# Altium schematic sheet SCH - ROBOTIC ARM.SchDoc
size A3; SheetNumber: 1; SheetTotal: 1
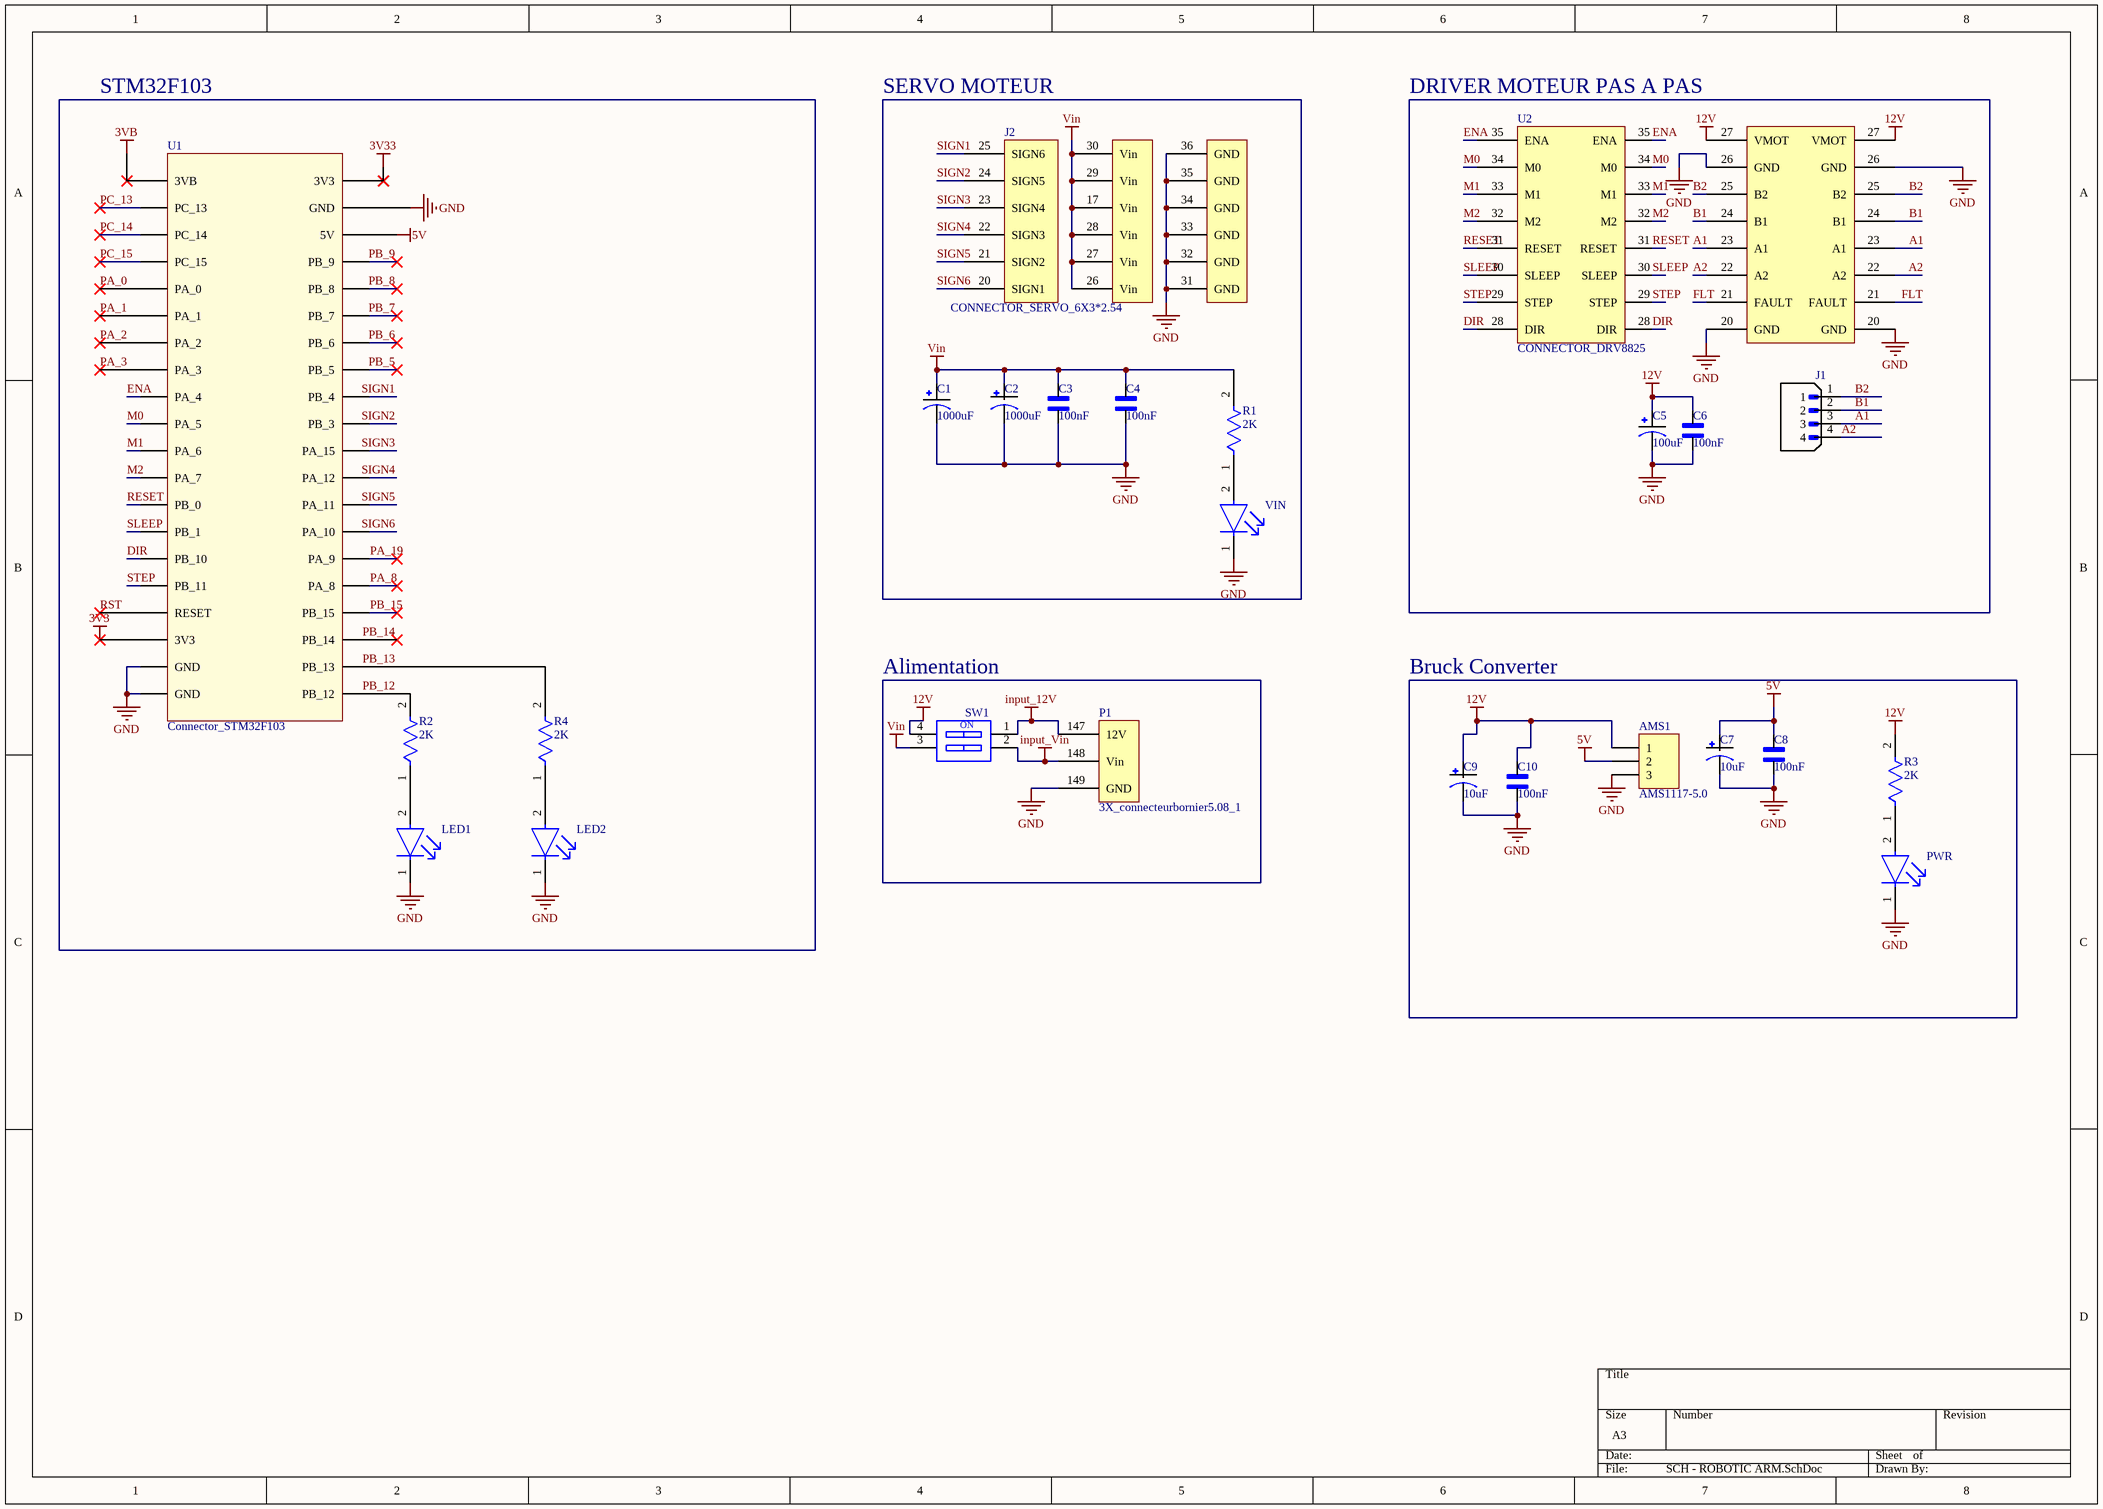
[diagram p0: SCH - ROBOTIC ARM.SchDoc]

## Parts
AMS1  AMS1117-5.0  [HDR1X3]
C1  1000uF  [*CAPPRD500W60D1000H1600_ECA1CM102(Primary)]
C2  1000uF  [*CAPPRD200W50D550H1250]
C3  100nF  [*CAPRR508W50L508T317H508]
C4  100nF  [*CAPRR508W50L508T317H508]
C5  100uF  [*CAPPRD500W60D1000H1600_ECA1CM102(Primary)]
C6  100nF  [*CAPRR508W50L508T317H508]
C7  10uF  [*CAPPRD200W50D550H1250]
C8  100nF  [*CAPRR508W50L508T317H508]
C9  10uF  [*CAPPRD200W50D550H1250]
C10  100nF  [*CAPPRD200W50D550H1250]
J1  B4B-XH-A(LF)(SN)  [*JST_B4B-XH-A(LF)(SN)]  (value not drawn)
J2  CONNECTOR_SERVO_6X3*2.54  [CONNECTOR_SERVO_6X3*2.54]
LED1  LED1  [FP-VSLB3940-MFG]  (value not drawn)
LED2  LED1  [FP-VSLB3940-MFG]  (value not drawn)
P1  3X_connecteurbornier5.08_1  [3X_connecteur_bornier_5.08]
PWR  LED1  [FP-VSLB3940-MFG]  (value not drawn)
R1  2K  [FP-CMF50-0]
R2  2K  [FP-CMF50-0]
R3  2K  [FP-CMF50-0]
R4  2K  [FP-CMF50-0]
SW1  418117170902  [418117170902]  (value not drawn)
U1  Connector_STM32F103  [Connector_STM32F103]
U2  CONNECTOR_DRV8825  [CONNECTOR_DRV8825]
VIN  LED1  [FP-VSLB3940-MFG]  (value not drawn)

## Nets
3V3: U1.143(3V3)
3V33: U1.105(3V3)
3VB: U1.126(3VB)
5V: AMS1.2 C7.1 C8.1 U1.107(5V)
12V: AMS1.1 C5.P C6.1 C9.1 C10.1 R3.2 SW1.4 U2.27(VMOT)
GND: AMS1.3 C1.N C2.2 C3.2 C4.2 C5.N C6.2 C7.2 C8.2 C9.2 C10.2 J2.31(GND) J2.32(GND) J2.33(GND) J2.34(GND) J2.35(GND) J2.36(GND) LED1.1(C) LED2.1(C) P1.149(GND) PWR.1(C) U1.106(GND) U1.144(GND) U1.145(GND) U2.20(GND) U2.26(GND) VIN.1(C)
input_12V: P1.147(12V) SW1.1
input_Vin: P1.148(Vin) SW1.2
Vin: C1.P C2.1 C3.1 C4.1 J2.17(Vin) J2.26(Vin) J2.27(Vin) J2.28(Vin) J2.29(Vin) J2.30(Vin) R1.2 SW1.3
A1: J1.3 U2.23(A1)
A2: J1.4 U2.22(A2)
B1: J1.2 U2.24(B1)
B2: J1.1 U2.25(B2)
DIR: U1.140(PB_10) U2.28(DIR)
ENA: U1.134(PA_4) U2.35(ENA)
FLT: U2.21(FAULT)
M0: U1.135(PA_5) U2.34(M0)
M1: U1.136(PA_6) U2.33(M1)
M2: U1.137(PA_7) U2.32(M2)
PA_0: U1.130(PA_0)
PA_1: U1.131(PA_1)
PA_2: U1.132(PA_2)
PA_3: U1.133(PA_3)
PA_8: U1.120(PA_8)
PA_19: U1.119(PA_9)
PB_5: U1.112(PB_5)
PB_6: U1.111(PB_6)
PB_7: U1.110(PB_7)
PB_8: U1.109(PB_8)
PB_9: U1.108(PB_9)
PB_12: R2.2 U1.124(PB_12)
PB_13: R4.2 U1.123(PB_13)
PB_14: U1.122(PB_14)
PB_15: U1.121(PB_15)
PC_13: U1.127(PC_13)
PC_14: U1.128(PC_14)
PC_15: U1.129(PC_15)
RESET: U1.138(PB_0) U2.31(RESET)
RST: U1.142(RESET)
SIGN1: J2.25(SIGN6) U1.113(PB_4)
SIGN2: J2.24(SIGN5) U1.114(PB_3)
SIGN3: J2.23(SIGN4) U1.115(PA_15)
SIGN4: J2.22(SIGN3) U1.116(PA_12)
SIGN5: J2.21(SIGN2) U1.117(PA_11)
SIGN6: J2.20(SIGN1) U1.118(PA_10)
SLEEP: U1.139(PB_1) U2.30(SLEEP)
STEP: U1.141(PB_11) U2.29(STEP)
NetLED1_2: LED1.2(A) R2.1
NetLED2_2: LED2.2(A) R4.1
NetPWR_2: PWR.2(A) R3.1
NetR1_1: R1.1 VIN.2(A)

## Notes on the sheet
- STM32F103
- SERVO MOTEUR
- (near U2) DRIVER MOTEUR PAS A PAS
- Alimentation
- Bruck Converter
- (in symbol CMP-1434-00002-3) ON

## Library data of the parts
AMS1 = Header 3: Header, 3-Pin; LatestRevisionDate: 17-Jul-2002; LatestRevisionNote: Re-released for DXP Platform.; Publisher: Altium Limited
C1 C5 = ECA1CM102: 1000ÂµF 16V Aluminum Electrolytic Capacitors Radial, Can 2000 Hrs @ 85Â°C; MF: Panasonic; Package: RADIAL-2 Panasonic; Price: None; SnapEDA_Link: https://www.snapeda.com/parts/ECA1CM102/Panasonic/view-part/?ref=snap; MP: ECA1CM102; Availability: In Stock; Check_prices: https://www.snapeda.com/parts/ECA1CM102/Panasonic/view-part/?ref=eda; Value: *
C2 C7 C9 = UVR1E100MDD: 10 ÂµF 25 V Aluminum Electrolytic Capacitors Radial, Can - 2000 Hrs @ 85Â°C; MF: Nichicon; Package: RADIAL-2 NICHICON; Price: None; SnapEDA_Link: https://www.snapeda.com/parts/UVR1E100MDD/Nichicon/view-part/?ref=snap; MP: UVR1E100MDD; Availability: In Stock; Check_prices: https://www.snapeda.com/parts/UVR1E100MDD/Nichicon/view-part/?ref=eda; Value: *
C3 C4 C6 C8 C10 = SR215E104MARTR1: SR Series 5.08x5.08 mm 100 nF 50 V Â±20% Tol. Z5U Radial Lead/SkyCapÂ®; MF: AVX; Package: Radial AVX Interconnect / Elco; Price: None; SnapEDA_Link: https://www.snapeda.com/parts/SR215E104MARTR1/AVX/view-part/?ref=snap; MP: SR215E104MARTR1; Availability: In Stock; Check_prices: https://www.snapeda.com/parts/SR215E104MARTR1/AVX/view-part/?ref=eda; Value: *
J1 = B4B-XH-A(LF)(SN): HEADER, VERTICAL, 4WAY; Pitch Spacing: 2.5mm; No. of Contacts: 4Contacts; Gender: Header; Product Range: XH Series; Contact Termination Type: Through Hole; No. of Rows: 1Rows; Contact Plating: Tin Plated Contacts; Contact Material: Brass; SVHC: No SVHC (17-Dec-2015); Contact Resistance: 10mohm; Current Rating: 3A; Insulation Resistance: 1000Mohm; Operating Temperature Max: 85Â°C; Operating Temperature Min: -25Â°C; Voltage Rating VAC: 250V; Wire Size AWG Max: 22AWG; Wire Size AWG Min: 30AWG; Withstand Voltage: 1000V; MF: JST; Package: None; Price: None; SnapEDA_Link: https://www.snapeda.com/parts/B4B-XH-A%20%20(LF)(SN)/JST/view-part/?ref=snap; MP: B4B-XH-A  (LF)(SN); Availability: In Stock; Check_prices: https://www.snapeda.com/parts/B4B-XH-A%20%20(LF)(SN)/JST/view-part/?ref=eda; Value: *
LED1 LED2 PWR VIN = CMP-00030-18785862-1: VSLB3940 940 nm 100 mA ±22° Through Hole High Speed Infrared Emitting Diode - T-1; Power Rating: 160mW; Rise Time: 15ns; Peak Wavelength: 940nm; Lens Style: Circular, Diffused, Round; Reverse Voltage: 5V; Viewing Angle: 44°; Forward Current: 100mA; Number of Elements: 1; Forward Voltage: 1.35V; Length: 3.2mm; Min Operating Temperature: -25°C; Radiation Hardening: No; Power Dissipation: 160mW; Lead Free: Lead Free; Orientation: Top View; Case/Package: T; Max Power Dissipation: 160mW; Max Operating Temperature: 85°C; Fall Time: 15ns; Number of Pins: 2; Test Current: 100mA; NexarPartId: 18785862; RoHS: Compliant; REACH SVHC: Unknown; Mount: Through Hole; Number of LEDs: 1; Wavelength: 940nm; Packaging: Bulk; Depth: 3.2mm
R1-R4 = CMP-00030-43762971-1: RN50C9532FB14 RN50 Series 0.05 W 95.3 kOhm ± 1% ±50 ppm/°C Axial Metal Film Resistor; Resistance: 95.3kΩ; Voltage Rating: 200V; Power Rating: 50mW; Lead Diameter: 410µm; Termination: Axial; Temperature Coefficient: 50ppm/°C; Number of Terminations: 2; Max Operating Temperature: 175°C; Case/Package: Axial; Height: 2.03mm; Tolerance: 1%; Radiation Hardening: No; Mount: Through Hole; Diameter: 1.65mm; Length: 3.81mm; Width: 1.651mm; RoHS: Non-Compliant; Max Power Dissipation: 50mW; Features: Flame Retardant Coating, Military; Composition: Metal Film; Contact Plating: Lead, Tin; Packaging: Bulk; Military Standard: MIL-R-10509; Lead Free: Contains Lead; Min Operating Temperature: -65°C; NexarPartId: 43762971
SW1 = CMP-1434-00002-3: Dip Switch, 0.025A, 24Vdc, 2 Pos, Tht Rohs Compliant: Yes; Insulation Resistance: 100MΩ; Current Rating: 25mA; Voltage Rating (DC): 24V; Washable: No; Electrical Life: 2kcycles; Throw Configuration: SPST; Body Material: PBT, Polybutylene; Number of Positions: 2; Pitch: 2.54mm; Contact Plating: Gold; Voltage Rating: 24V; Min Operating Temperature: -40°C; Termination: PC Pin; RoHS: Compliant; Mechanical Life: 2kcycles; Length: 6.08mm; Max Operating Temperature: 85°C